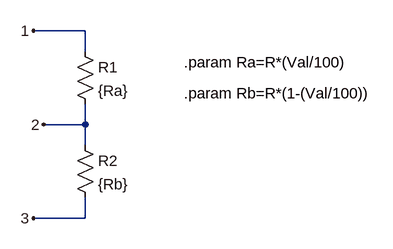
[diagram p0: schematic pot.asc]
pot.asc, the LTspice schematic file:
Version 4
SHEET 1 880 680
WIRE 160 -96 80 -96
WIRE 160 -64 160 -96
WIRE 160 48 160 16
WIRE 160 48 96 48
WIRE 160 80 160 48
WIRE 160 192 160 160
WIRE 160 192 80 192
FLAG 80 -96 1
FLAG 96 48 2
FLAG 80 192 3
SYMBOL res 144 -80 R0
SYMATTR InstName R1
SYMATTR Value {Ra}
SYMBOL res 144 64 R0
SYMATTR InstName R2
SYMATTR Value {Rb}
TEXT 312 -48 Left 2 !.param Ra=R*(Val/100)
TEXT 312 0 Left 2 !.param Rb=R*(1-(Val/100))

The netlist it stands for:
* pot.asc
R1 1 2 {Ra}
R2 2 3 {Rb}
.param Ra=R*(Val/100)
.param Rb=R*(1-(Val/100))
.backanno
.end